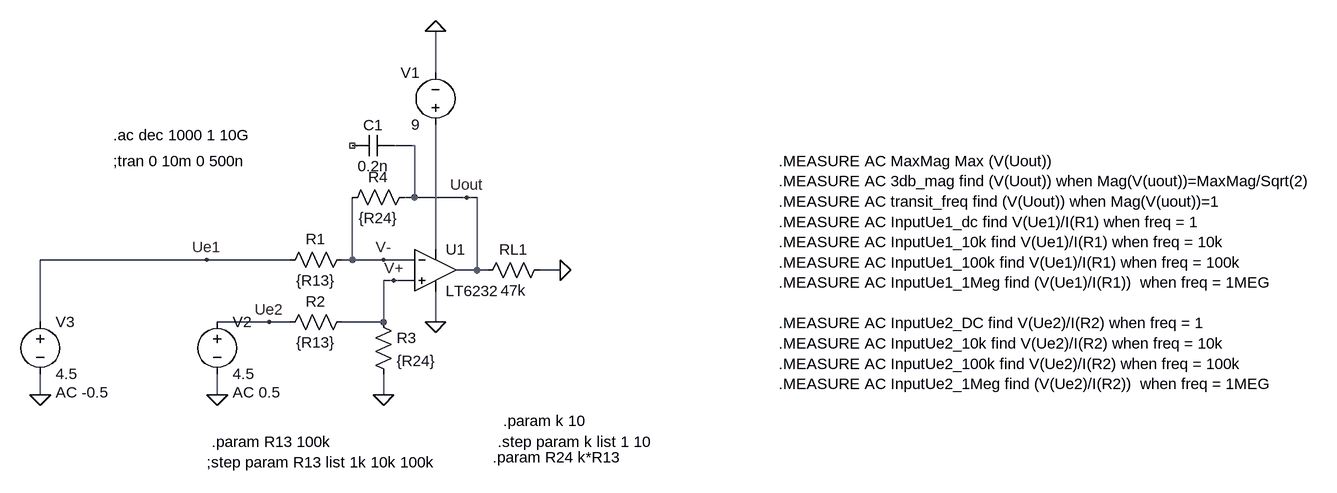
[diagram p0: schematic Subtrahierer_Test_offset.asc]
Subtrahierer_Test_offset.asc, the LTspice schematic file:
Version 4
SHEET 1 2172 680
WIRE 240 -368 240 -432
WIRE 208 -256 176 -256
WIRE 208 -176 208 -256
WIRE 208 -176 192 -176
WIRE 288 -176 208 -176
WIRE 304 -176 288 -176
WIRE 240 -96 240 -288
WIRE -112 -80 -368 -80
WIRE 16 -80 -112 -80
WIRE 112 -80 112 -176
WIRE 112 -80 96 -80
WIRE 160 -80 112 -80
WIRE 208 -80 160 -80
WIRE 304 -64 304 -176
WIRE 304 -64 272 -64
WIRE 320 -64 304 -64
WIRE 432 -64 400 -64
WIRE 176 -48 160 -48
WIRE 208 -48 176 -48
WIRE -368 16 -368 -80
WIRE -16 16 -96 16
WIRE 16 16 -16 16
WIRE 160 16 160 -48
WIRE 160 16 96 16
WIRE 240 16 240 -32
WIRE -368 128 -368 96
WIRE -96 128 -96 96
WIRE 160 128 160 96
FLAG 240 -432 0
FLAG 240 16 0
FLAG 432 -64 0
FLAG 160 128 0
FLAG -96 128 0
FLAG -16 16 Ue2
FLAG -112 -80 Ue1
FLAG 288 -176 Uout
FLAG -368 128 0
FLAG 160 -80 V-
FLAG 176 -48 V+
SYMBOL voltage 240 -272 R180
WINDOW 0 24 96 Left 2
WINDOW 3 24 16 Left 2
WINDOW 123 0 0 Left 2
WINDOW 39 0 0 Left 2
SYMATTR InstName V1
SYMATTR Value 9
SYMBOL res 304 -48 R270
WINDOW 0 32 56 VTop 2
WINDOW 3 0 56 VBottom 2
SYMATTR InstName RL1
SYMATTR Value 47k
SYMBOL res 0 -64 R270
WINDOW 0 32 56 VTop 2
WINDOW 3 0 56 VBottom 2
SYMATTR InstName R1
SYMATTR Value {R13}
SYMBOL res 0 32 R270
WINDOW 0 32 56 VTop 2
WINDOW 3 0 56 VBottom 2
SYMATTR InstName R2
SYMATTR Value {R13}
SYMBOL res 144 0 R0
SYMATTR InstName R3
SYMATTR Value {R24}
SYMBOL res 208 -192 R90
WINDOW 0 0 56 VBottom 2
WINDOW 3 32 56 VTop 2
SYMATTR InstName R4
SYMATTR Value {R24}
SYMBOL voltage -96 0 R0
WINDOW 123 24 124 Left 2
WINDOW 39 0 0 Left 2
SYMATTR Value2 AC 0.5
SYMATTR InstName V2
SYMATTR Value 4.5
SYMBOL voltage -368 0 R0
WINDOW 123 24 124 Left 2
WINDOW 39 0 0 Left 2
SYMATTR Value2 AC -0.5
SYMATTR InstName V3
SYMATTR Value 4.5
SYMBOL Opamps\\LT6232 240 -64 R0
SYMATTR InstName U1
SYMBOL cap 176 -272 R90
WINDOW 0 0 32 VBottom 2
WINDOW 3 32 32 VTop 2
SYMATTR InstName C1
SYMATTR Value 0.2n
TEXT -256 -232 Left 2 !;tran 0 10m 0 500n
TEXT -112 232 Left 2 !;step param R13 list 1k 10k 100k
TEXT 328 224 Left 2 !.param R24 k*R13
TEXT -104 200 Left 2 !.param R13 100k
TEXT 336 200 Left 2 !.step param k list 1 10
TEXT 344 168 Left 2 !.param k 10
TEXT -256 -272 Left 2 !.ac dec 1000 1 10G
TEXT 768 -232 Left 2 !.MEASURE AC MaxMag Max (V(Uout))\n.MEASURE AC 3db_mag find (V(Uout)) when Mag(V(uout))=MaxMag/Sqrt(2)\n.MEASURE AC transit_freq find (V(Uout)) when Mag(V(uout))=1\n.MEASURE AC InputUe1_dc find V(Ue1)/I(R1) when freq = 1\n.MEASURE AC InputUe1_10k find V(Ue1)/I(R1) when freq = 10k\n.MEASURE AC InputUe1_100k find V(Ue1)/I(R1) when freq = 100k\n.MEASURE AC InputUe1_1Meg find (V(Ue1)/I(R1))  when freq = 1MEG\n \n.MEASURE AC InputUe2_DC find V(Ue2)/I(R2) when freq = 1\n.MEASURE AC InputUe2_10k find V(Ue2)/I(R2) when freq = 10k\n.MEASURE AC InputUe2_100k find V(Ue2)/I(R2) when freq = 100k\n.MEASURE AC InputUe2_1Meg find (V(Ue2)/I(R2))  when freq = 1MEG

The netlist it stands for:
* Subtrahierer_Test_offset.asc
V1 N001 0 9
RL1 Uout 0 47k
R1 Ue1 V- {R13}
R2 Ue2 V+ {R13}
R3 V+ 0 {R24}
R4 Uout V- {R24}
V2 Ue2 0 4.5 AC 0.5
V3 Ue1 0 4.5 AC -0.5
* U1: LT6232 (symbol Opamps\LT6232 not available, pins judged from their places): In+=V+ In-=V- V+=N001 V-=0 OUT=Uout
C1 Uout NC_01 0.2n
;tran 0 10m 0 500n
;step param R13 list 1k 10k 100k
.param R24 k*R13
.param R13 100k
.step param k list 1 10
.param k 10
.ac dec 1000 1 10G
.MEASURE AC MaxMag Max (V(Uout))
.MEASURE AC 3db_mag find (V(Uout)) when Mag(V(uout))=MaxMag/Sqrt(2)
.MEASURE AC transit_freq find (V(Uout)) when Mag(V(uout))=1
.MEASURE AC InputUe1_dc find V(Ue1)/I(R1) when freq = 1
.MEASURE AC InputUe1_10k find V(Ue1)/I(R1) when freq = 10k
.MEASURE AC InputUe1_100k find V(Ue1)/I(R1) when freq = 100k
.MEASURE AC InputUe1_1Meg find (V(Ue1)/I(R1))  when freq = 1MEG
.MEASURE AC InputUe2_DC find V(Ue2)/I(R2) when freq = 1
.MEASURE AC InputUe2_10k find V(Ue2)/I(R2) when freq = 10k
.MEASURE AC InputUe2_100k find V(Ue2)/I(R2) when freq = 100k
.MEASURE AC InputUe2_1Meg find (V(Ue2)/I(R2))  when freq = 1MEG
.backanno
.end